# Altium schematic sheet stm32.SchDoc
size A3
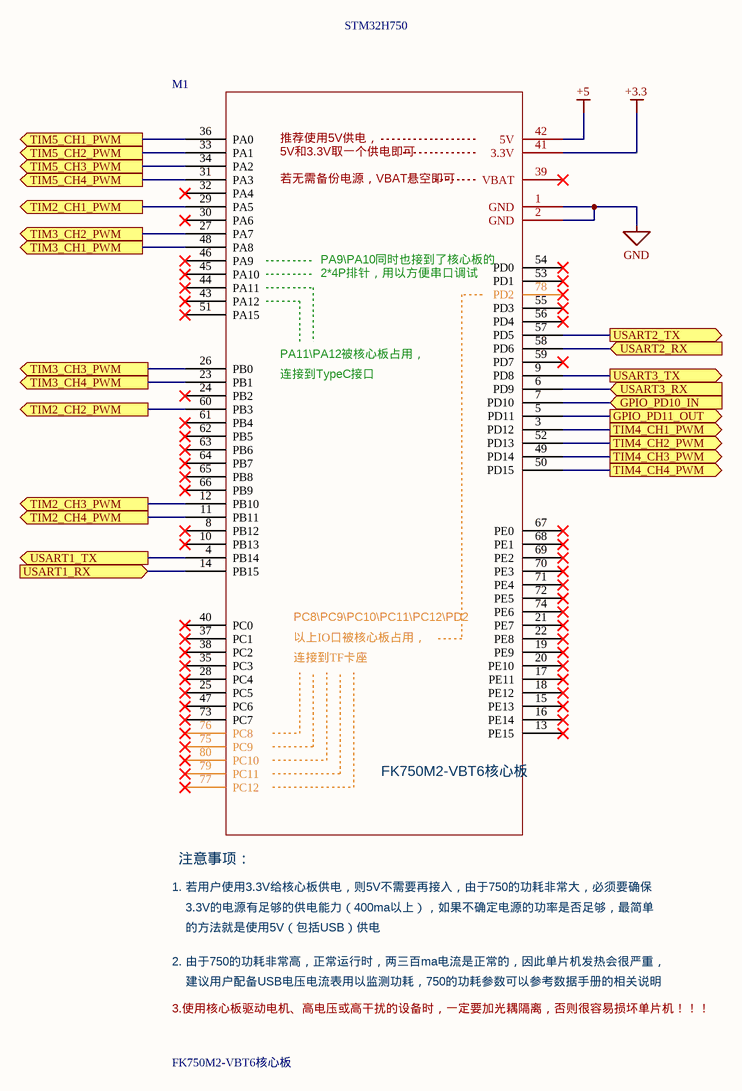
[diagram p0: stm32.SchDoc]

## Parts
M1  FK750M2-VBT6核心板  [FK750M2-VBT6(精简版)]

## Ports
GPIO_PD10_IN (in), GPIO_PD11_OUT (out), TIM2_CH1_PWM (out), TIM2_CH2_PWM (out), TIM2_CH3_PWM (out), TIM2_CH4_PWM (out), TIM3_CH1_PWM (out), TIM3_CH2_PWM (out), TIM3_CH3_PWM (out), TIM3_CH4_PWM (out), TIM4_CH1_PWM (out), TIM4_CH2_PWM (out), TIM4_CH3_PWM (out), TIM4_CH4_PWM (out), TIM5_CH1_PWM (out), TIM5_CH2_PWM (out), TIM5_CH3_PWM (out), TIM5_CH4_PWM (out), USART1_RX (in), USART1_TX (out), USART2_RX (in), USART2_TX (out), USART3_RX (in), USART3_TX (out)

## Nets
+3.3: M1.41(3.3V)
+5: M1.42(5V)
GND: M1.1(GND) M1.2(GND)
GPIO_PD10_IN: M1.7(PD10) ; port GPIO_PD10_IN
GPIO_PD11_OUT: M1.5(PD11) ; port GPIO_PD11_OUT
TIM2_CH1_PWM: M1.29(PA5) ; port TIM2_CH1_PWM
TIM2_CH2_PWM: M1.60(PB3) ; port TIM2_CH2_PWM
TIM2_CH3_PWM: M1.12(PB10) ; port TIM2_CH3_PWM
TIM2_CH4_PWM: M1.11(PB11) ; port TIM2_CH4_PWM
TIM3_CH1_PWM: M1.48(PA8) ; port TIM3_CH1_PWM
TIM3_CH2_PWM: M1.27(PA7) ; port TIM3_CH2_PWM
TIM3_CH3_PWM: M1.26(PB0) ; port TIM3_CH3_PWM
TIM3_CH4_PWM: M1.23(PB1) ; port TIM3_CH4_PWM
TIM4_CH1_PWM: M1.3(PD12) ; port TIM4_CH1_PWM
TIM4_CH2_PWM: M1.52(PD13) ; port TIM4_CH2_PWM
TIM4_CH3_PWM: M1.49(PD14) ; port TIM4_CH3_PWM
TIM4_CH4_PWM: M1.50(PD15) ; port TIM4_CH4_PWM
TIM5_CH1_PWM: M1.36(PA0) ; port TIM5_CH1_PWM
TIM5_CH2_PWM: M1.33(PA1) ; port TIM5_CH2_PWM
TIM5_CH3_PWM: M1.34(PA2) ; port TIM5_CH3_PWM
TIM5_CH4_PWM: M1.31(PA3) ; port TIM5_CH4_PWM
USART1_RX: M1.14(PB15) ; port USART1_RX
USART1_TX: M1.4(PB14) ; port USART1_TX
USART2_RX: M1.58(PD6) ; port USART2_RX
USART2_TX: M1.57(PD5) ; port USART2_TX
USART3_RX: M1.6(PD9) ; port USART3_RX
USART3_TX: M1.9(PD8) ; port USART3_TX

Not connected (* = marked no-connect by the designer): M1 8(PB12)* 10(PB13)* 13(PE15)* 15(PE13)* 16(PE14)* 17(PE11)* 18(PE12)* 19(PE9)* 20(PE10)* 21(PE7)* 22(PE8)* 24(PB2)* 25(PC5)* 28(PC4)* 30(PA6)* 32(PA4)* 35(PC3)* 37(PC1)* 38(PC2)* 39(VBAT)* 40(PC0)* 43(PA12)* 44(PA11)* 45(PA10)* 46(PA9)* 47(PC6)* 51(PA15)* 53(PD1)* 54(PD0)* 55(PD3)* 56(PD4)* 59(PD7)* 61(PB4)* 62(PB5)* 63(PB6)* 64(PB7)* 65(PB8)* 66(PB9)* 67(PE0)* 68(PE1)* 69(PE2)* 70(PE3)* 71(PE4)* 72(PE5)* 73(PC7)* 74(PE6)* 75(PC9)* 76(PC8)* 77(PC12)* 78(PD2)* 79(PC11)* 80(PC10)*

## Notes on the sheet
- STM32H750
- (in symbol FK750M2-VBT6) 推荐使用5V供电，; 5V和3.3V取一个供电即可; 若无需备份电源，VBAT悬空即可; PA9\PA10同时也接到了核心板的; 2*4P排针，用以方便串口调试; PA11\PA12被核心板占用，; 连接到TypeC接口; PC8\PC9\PC10\PC11\PC12\PD2; 以上IO口被核心板占用，; 连接到TF卡座; 注意事项：; 1. 若用户使用3.3V给核心板供电，则5V不需要再接入，由于750的功耗非常大，必须要确保; 3.3V的电源有足够的供电能力（400ma以上），如果不确定电源的功率是否足够，最简单; 的方法就是使用5V（包括USB）供电; 2. 由于750的功耗非常高，正常运行时，两三百ma电流是正常的，因此单片机发热会很严重，; 建议用户配备USB电压电流表用以监测功耗，750的功耗参数可以参考数据手册的相关说明; 3.使用核心板驱动电机、高电压或高干扰的设备时，一定要加光耦隔离，否则很容易损坏单片机！！！

## Library data of the parts
M1 = FK750M2-VBT6